# EAGLE design relay_shield3a (EAGLE 7.7.0)
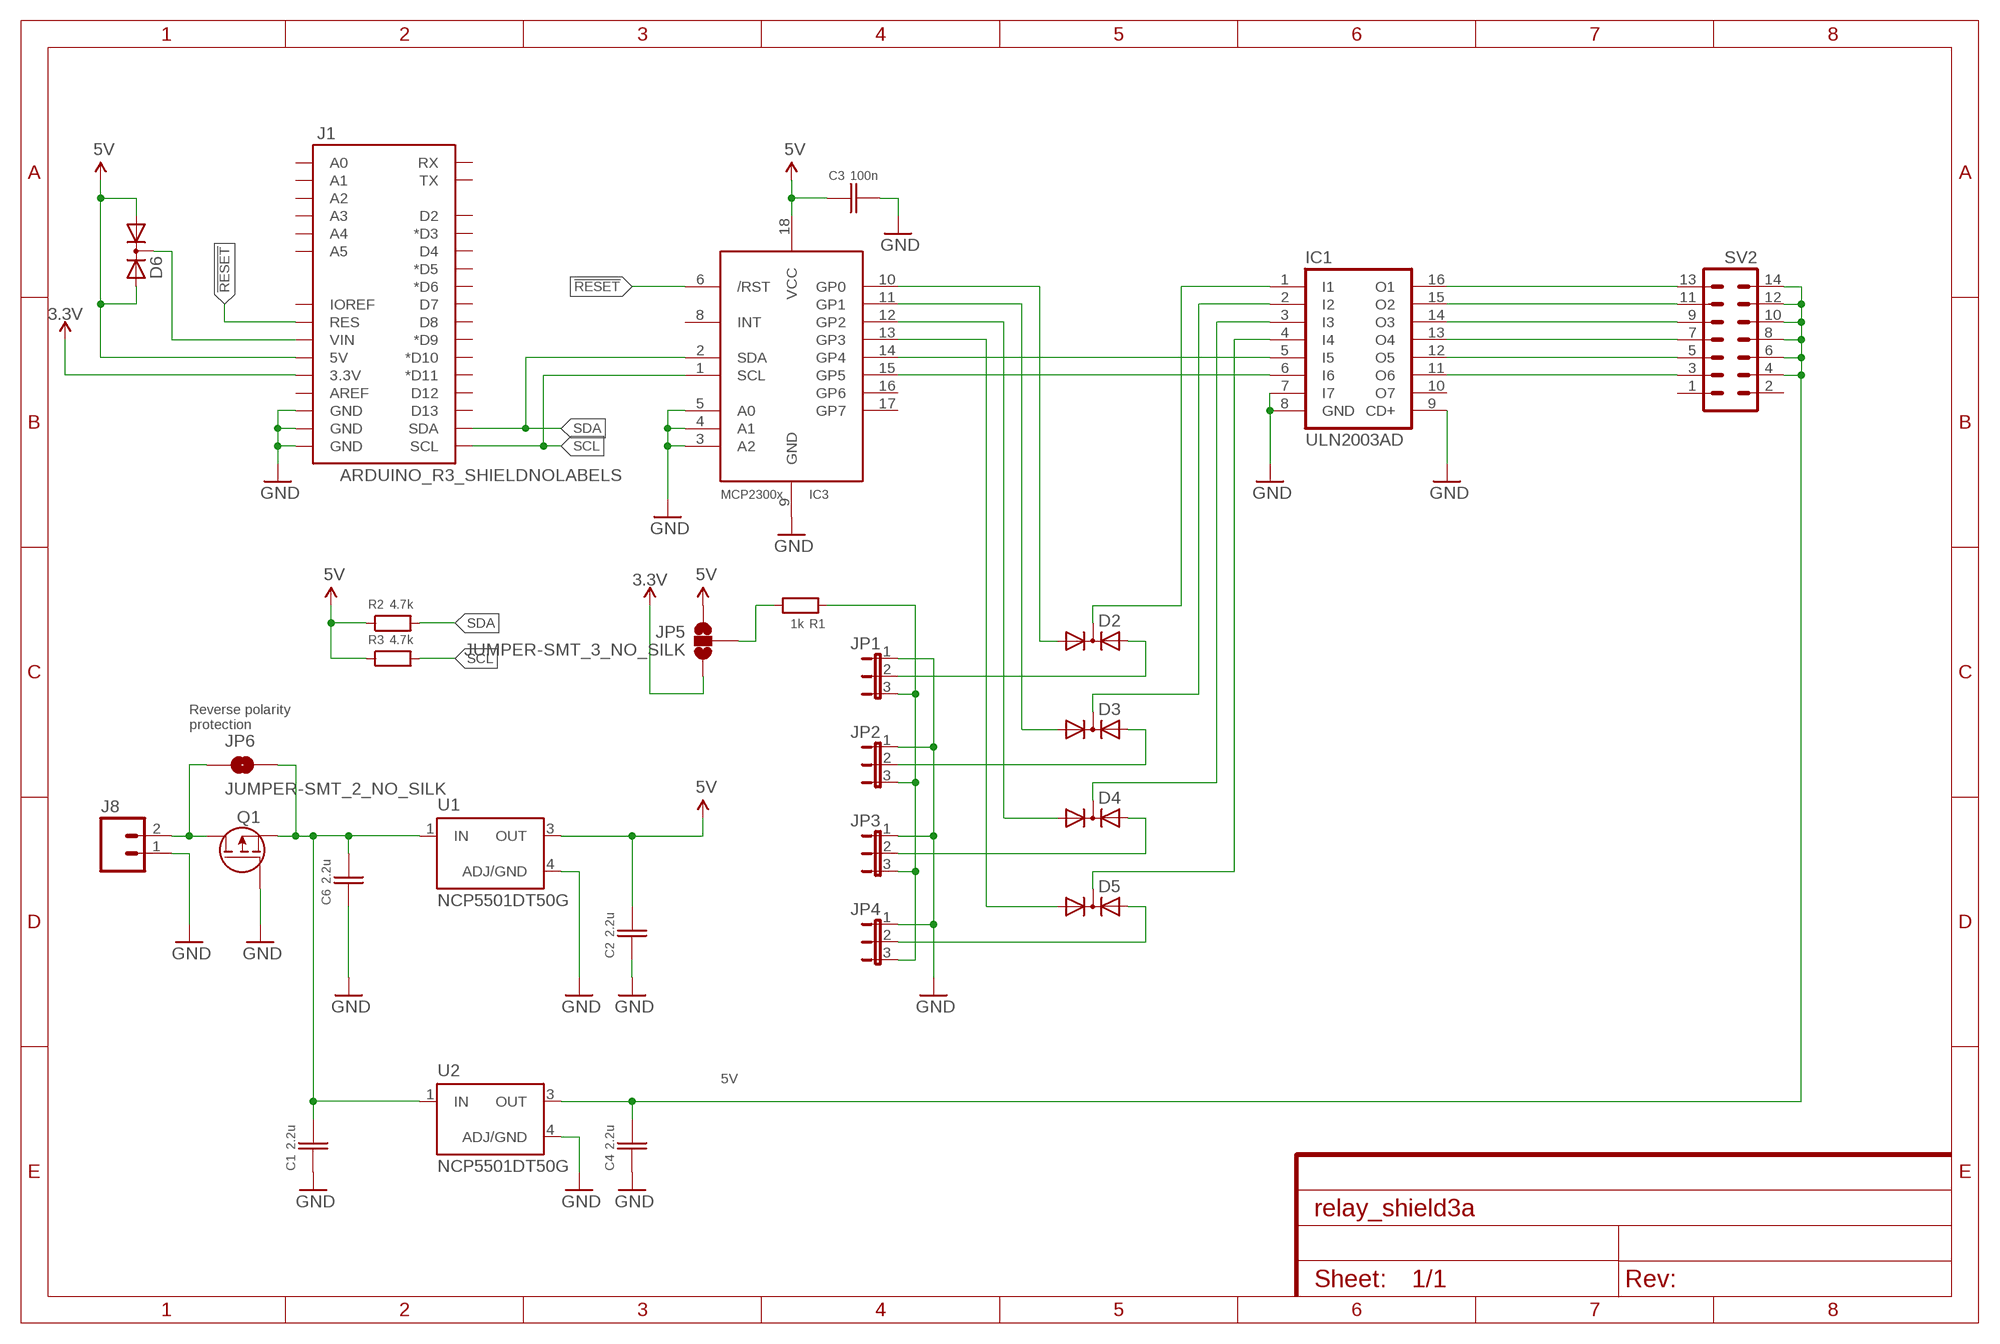
[diagram p0: schematic, sheet 1]

## Parts
C1  2.2u  CAPACITOR_NPOL-1206  [C1206]
C2  2.2u  CAPACITOR_NPOL-1206  [C1206]
C3  100n  CAPACITOR_NPOL-0603  [C603]
C4  2.2u  CAPACITOR_NPOL-1206  [C1206]
C6  2.2u  CAPACITOR_NPOL-1206  [C1206]
D2  DIODE-2AC|CASOT23  [SOT23]
D3  DIODE-2AC|CASOT23  [SOT23]
D4  DIODE-2AC|CASOT23  [SOT23]
D5  DIODE-2AC|CASOT23  [SOT23]
D6  DIODE-2AC|CASOT23  [SOT23]
IC1  ULN2003AD  [SO16]
IC3  MCP23008/SO  [SO18W]
J1  ARDUINO_R3_SHIELDNOLABELS  [UNO_R3_SHIELD_NOLABELS]
J8  M023.5MM  [SCREWTERMINAL-3.5MM-2]
JP1  JP2E  [JP2]
JP2  JP2E  [JP2]
JP3  JP2E  [JP2]
JP4  JP2E  [JP2]
JP5  JUMPER-SMT_3_NO_SILK  [SMT-JUMPER_3_NO_SILK]
JP6  JUMPER-SMT_2_NO_SILK  [SMT-JUMPER_2_NO_SILK]
Q1  MOSFET-P-SOT23-3  [SOT23-3]
R1  1k  RESISTOR-0603  [R0603]
R2  4.7k  RESISTOR-0603  [R0603]
R3  4.7k  RESISTOR-0603  [R0603]
SV2  ML14L  [ML14L]
U1  NCP5501DT50G  VREG-3PIN-DPAK  [DPAK]
U2  NCP5501DT50G  VREG-3PIN-DPAK  [DPAK]

## Nets
3.3V: J1.3.3V JP5.3
5V: C2.2 C3.1 D6.1(A1) D6.2(A2) IC3.18(VCC) J1.5V JP5.1 R2.1 R3.1 U1.3(OUT)
!RESET: IC3.6(/RST) J1.RES
GND: C1.1 C2.1 C3.2 C4.1 C6.1 IC1.7(I7) IC1.8(GND) IC1.9(CD+) IC3.3(A2) IC3.4(A1) IC3.5(A0) IC3.9(GND) J1.GND@0(GND) J1.GND@1(GND) J1.GND@2(GND) J8.1 JP1.1 JP2.1 JP3.1 JP4.1 Q1.1(G) U1.4(ADJ/GND) U2.4(ADJ/GND)
N$1: D2.2(A2) JP1.2
N$2: D3.2(A2) JP2.2
N$3: IC1.16(O1) SV2.13
N$4: C1.2 C6.2 JP6.2 Q1.2(S) U1.1(IN) U2.1(IN)
N$6: C4.2 SV2.4 SV2.6 SV2.8 SV2.10 SV2.12 SV2.14 U2.3(OUT)
N$13: IC1.15(O2) SV2.11
N$14: IC1.14(O3) SV2.9
N$15: IC1.13(O4) SV2.7
N$16: IC1.12(O5) SV2.5
N$17: IC1.11(O6) SV2.3
N$18: D2.3(C) IC1.1(I1)
N$19: D3.3(C) IC1.2(I2)
N$20: D4.3(C) IC1.3(I3)
N$21: D5.3(C) IC1.4(I4)
N$22: IC1.5(I5) IC3.14(GP4)
N$23: IC1.6(I6) IC3.15(GP5)
N$24: D6.3(C) J1.VIN
N$25: D4.2(A2) JP3.2
N$26: D5.2(A2) JP4.2
N$27: D2.1(A1) IC3.10(GP0)
N$28: D3.1(A1) IC3.11(GP1)
N$29: D4.1(A1) IC3.12(GP2)
N$30: D5.1(A1) IC3.13(GP3)
N$31: J8.2 JP6.1 Q1.3(D)
N$44: JP1.3 JP2.3 JP3.3 JP4.3 R1.1
N$47: JP5.2 R1.2
SCL: IC3.1(SCL) J1.SCL R3.2
SDA: IC3.2(SDA) J1.SDA R2.2
Unconnected: IC1.10(O7) IC3.8(INT) IC3.16(GP6) IC3.17(GP7) J1.A0 J1.A1 J1.A2 J1.A3 J1.A4 J1.A5 J1.AREF J1.D2 J1.D3(*D3) J1.D4 J1.D5(*D5) J1.D6(*D6) J1.D7 J1.D8 J1.D9(*D9) J1.D10(*D10) J1.D11(*D11) J1.D12 J1.D13 J1.IOREF J1.RX J1.TX SV2.1 SV2.2

## Notes on the sheet
- Reverse polarity
  protection
- 5V

## Library data of the parts
C1-C4 C6 = kg-generic:CAPACITOR_NPOL: Non-Polarized capacitor in various packages
D2-D6 = diode:DIODE-2AC|CA: Dual DIODE Anode-Cathode|Cathode-Anode
IC1 = uln-udn:ULN2003A: DRIVER ARRAY
IC3 = adafruit:MCP23008: MCP23008 Inexpensive i2c i/o expander - 8 general purpose i/o pins with optional pullups
J1 = SparkFun-Boards:ARDUINO_R3_SHIELD: Shield form compatible with the Arduino Uno R3.
J8 = SparkFun-Connectors:M02: Standard 2-pin 0.1" header. Use with - straight break away headers ( PRT-00116) - right angle break away headers (PRT-00553) - swiss pins (PRT-00743) - machine pins (PRT-00117) - female headers (PRT-00115) Molex polarized connector foot print use with: PRT-08233 with associated crimp pins and housings. 2.54_SCREWTERM for use with PRT-10571. 3.5mm Screw Terminal footprints for PRT-08084 5mm Screw Terminal footprints for use with PRT-08432; PROD_ID: CONN-08399
JP1-JP4 = jumper:JP2E: JUMPER
JP5 = SparkFun-Jumpers:JUMPER-SMT_3_NO: Normally open jumper This jumper has three pads in close proximity to each other. Apply solder to close the connection(s).
JP6 = SparkFun-Jumpers:JUMPER-SMT_2_NO: Normally open jumper This jumper has two pads in close proximity to each other. Apply solder to close the connection. Round pads are easier to solder for beginners, but are a lot larger. SparkFun Product that uses the round pads: SparkFun EL Sequencer <https://www.sparkfun.com/products/12781>
Q1 = kg-generic:MOSFET-P: Generic P-MOSFET IRF7406 SO8 30V 5.8A 45mOhm IRLML6401 SOT23-3 12V 4.3A 50mOhm IRLML6402 SOT23-3 20V 3.7A 65mOhm
R1-R3 = kg-generic:RESISTOR: Generic resistor
SV2 = con-ml:ML14L: HARTING; OC_FARNELL: unknown; OC_NEWARK: unknown
U1 U2 = kg-generic:VREG-3PIN: Generic 3-pin linear voltage regulator

## Board
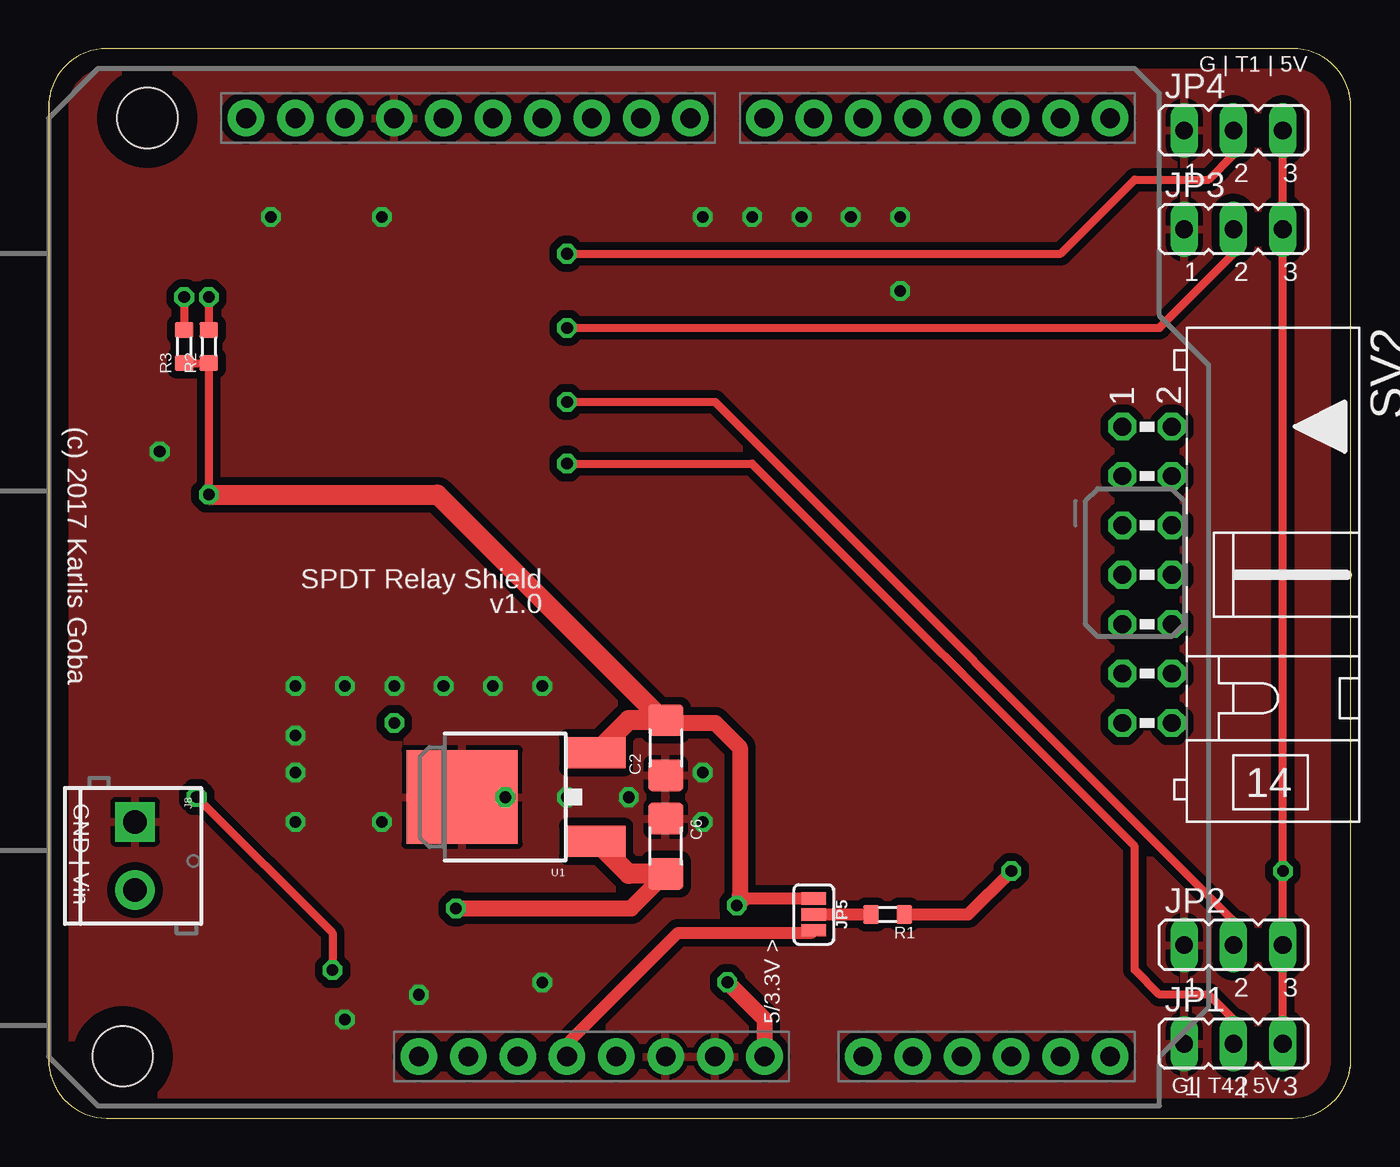
[diagram p1: board, top side]
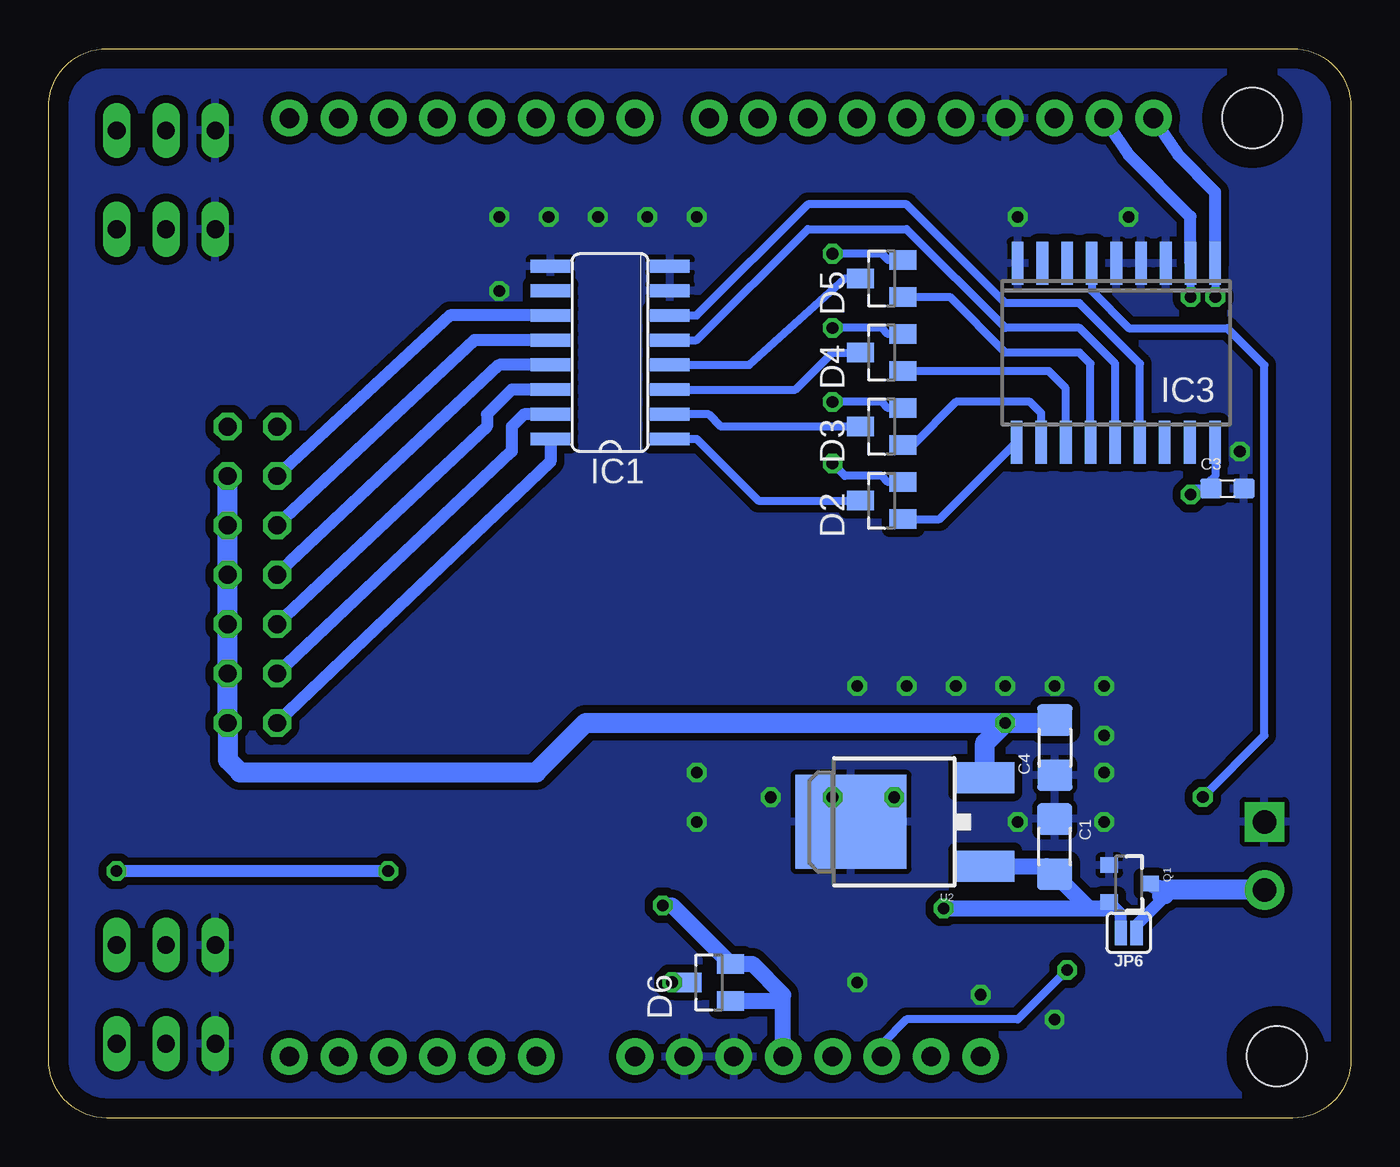
[diagram p2: board, bottom side, seen from below]

Size 67 x 55 mm. Coordinates in mm from the lower left corner, seen from the top.
Outline: 0,52 0,3 arc90 3,0 64,0 arc90 67,3 67,52 arc90 64,55 3,55 arc90 0,52
Copper layers (1*16): Top 0.035mm / dielectric 1.5mm / Bottom 0.035mm
Design rules "default": minimum track width 10mil, minimum drill 24mil, track to track 8mil, track to pad 8mil, pad to pad 8mil, via to via 8mil, smd to smd 8mil, copper to edge 40mil, drill to drill 8mil, minimum pad ring 10mil, minimum via ring 8mil, stop-mask expansion 4mil, vias tented up to drill 0mil, thermal gap 10mil
Holes 3.1 mm at 3.81,3.17 5.08,51.44

### Footprints (pad centres in the part's own frame; a part is rotated, then mirrored left to right if it is on the bottom)
C1206 = smd 1.6 x 1.803: 1 -1.422,0; 2 1.422,0
C603 = smd 1.1 x 1: 1 -0.85,0; 2 0.85,0
SOT23 = smd 1 x 1.4: 1 -0.95,-1.1; 2 0.95,-1.1; 3 0,1.1
SO16 = smd 0.66 x 2.032: 1 -4.445,-3.073; 2 -3.175,-3.073; 3 -1.905,-3.073; 4 -0.635,-3.073; 5 0.635,-3.073; 6 1.905,-3.073; 7 3.175,-3.073; 8 4.445,-3.073; 9 4.445,3.073; 10 3.175,3.073; 11 1.905,3.073; 12 0.635,3.073; 13 -0.635,3.073; 14 -1.905,3.073; 15 -3.175,3.073; 16 -4.445,3.073
SO18W = smd 0.6 x 2.2: 1 -4.445,-4.6; 2 -3.175,-4.6; 3 -1.905,-4.6; 4 -0.635,-4.6; 5 0.635,-4.6; 6 1.905,-4.6; 7 3.175,-4.6; 8 4.445,-4.6; 9 5.715,-4.6; 10 5.775,4.6; 11 4.505,4.6; 12 3.235,4.6; 13 1.965,4.6; 14 0.695,4.6; 15 -0.575,4.6; 16 -1.845,4.6; 17 -3.145,4.6; 18 -4.445,4.6
UNO_R3_SHIELD_NOLABELS = drill 1.016 pad 1.88: 3.3V 50.8,26.67; 5V 50.8,29.21; A0 50.8,41.91; A1 50.8,44.45; A2 50.8,46.99; A3 50.8,49.53; A4 50.8,52.07; A5 50.8,54.61; AREF 2.54,15.24; D2 2.54,49.53; D3 2.54,46.99; D4 2.54,44.45; D5 2.54,41.91; D6 2.54,39.37; D7 2.54,36.83; D8 2.54,33.02; D9 2.54,30.48; D10 2.54,27.94; D11 2.54,25.4; D12 2.54,22.86; D13 2.54,20.32; GND@0 50.8,31.75; GND@1 50.8,34.29; GND@2 2.54,17.78; IOREF 50.8,21.59; NC 50.8,19.05; RES 50.8,24.13; RX 2.54,54.61; SCL 2.54,10.16; SDA 2.54,12.7; TX 2.54,52.07; VIN 50.8,36.83
SCREWTERMINAL-3.5MM-2 = drill 1.2 pad 2.032 square: 1 0,0 | drill 1.2 pad 2.032: 2 3.5,0
JP2 = drill 0.914 long: 1 -2.54,0; 2 0,0; 3 2.54,0
SMT-JUMPER_3_NO_SILK = smd 0.635 x 1.27: 1 -0.813,0; 2 0,0; 3 0.813,0
SMT-JUMPER_2_NO_SILK = smd 0.635 x 1.27: 1 -0.406,0; 2 0.406,0
SOT23-3 = smd 0.8 x 0.9: 1 -0.95,-1; 2 0.95,-1; 3 0,1.1
R0603 = smd 0.8 x 0.95: 1 -0.85,0; 2 0.85,0
ML14L = drill 0.914 octagon: 1 -7.62,-1.27; 2 -7.62,1.27; 3 -5.08,-1.27; 4 -5.08,1.27; 5 -2.54,-1.27; 6 -2.54,1.27; 7 0,-1.27; 8 0,1.27; 9 2.54,-1.27; 10 2.54,1.27; 11 5.08,-1.27; 12 5.08,1.27; 13 7.62,-1.27; 14 7.62,1.27
DPAK = smd 1.6 x 3: 1 -2.28,-5.31; 3 2.28,-5.31 | smd 4.826 x 5.715: 4 0,1.588

### Placement (x,y rotation side)
C1  15.24,13.96 270 bottom
C2  31.75,19.04 90 top
C3  6.35,32.38 0 bottom
C4  15.23,19.05 90 bottom
C6  31.75,13.98 270 top
D2  24.14,31.75 90 bottom
D3  24.14,35.56 90 bottom
D4  24.14,39.37 90 bottom
D5  24.14,43.18 90 bottom
D6  33.02,6.97 90 bottom
IC1  38.11,39.37 90 bottom
IC3  11.43,39.36 180 bottom
J1  0,53.97 270 top
J8  4.45,15.23 270 top
JP1  60.96,3.82 0 top
JP2  60.96,8.9 0 top
JP3  60.96,45.71 0 top
JP4  60.96,50.79 0 top
JP5  39.36,10.47 270 top
JP6  11.43,9.53 180 bottom
Q1  11.43,12.05 270 bottom
R1  43.17,10.47 180 top
R2  8.24,39.68 90 top
R3  6.97,39.68 90 top
SV2  56.52,27.94 270 top
U1  22.86,16.51 90 top
U2  24.13,15.23 90 bottom

### Tracks (layer width: path | path; a pad name or v marks a point on that pad's centre or on a via)
3.3V
  Top 0.61: J1.3.3V 26.67,3.81 32.38,9.53 39.23,9.53 JP5.3
5V  (via drill 0.6)
  Top 0.406: v8.24,32.06 R2.1 R3.1
  Top 0.61: JP5.1 35.75,11.28
  Top 0.813: v35.41,10.94 35.75,11.28 35.56,11.48 35.56,19.05 34.29,20.32 31.75,20.32
  Top 1.016: v8.24,32.06 20.01,32.06 31.75,20.32 C2.2 29.84,20.46 U1.3
  Bottom 0.406: IC3.18 6.99,33.01 7.3,32.69 | 7.3,32.69 7.62,32.38 7.93,32.38 v8.24,32.06 | C3.1 7.2,32.59 7.3,32.69
  Bottom 0.813: J1.5V 29.21,6.34 | D6.1 29.52,6.03 29.21,6.34 | 29.21,6.34 30.8,7.92 D6.2 34.93,10.94 v35.41,10.94
!RESET  (via drill 0.6)
  Top 0.406: v14.61,7.61 14.61,9.53 v7.62,16.51
  Bottom 0.406: IC3.6 13.34,42.53 11.43,40.63 6.35,40.63 4.45,38.73 4.45,19.68 v7.61,16.51 v7.62,16.51 | v14.61,7.61 17.14,5.07 22.86,5.07 24.13,3.8 J1.RES
GND  (via drill 0.6)
  other vias: 19.05,6.34 25.4,6.97 12.7,17.77 17.14,46.34 5.71,34.28 11.43,46.34 15.24,5.07 23.5,16.5 26.67,16.5 33.66,46.34 36.2,46.34 38.73,46.34 41.27,46.34 43.81,46.34 43.81,42.53 17.14,15.23 33.66,17.77 33.66,15.23 29.84,16.5 25.4,22.21 22.86,22.21 20.32,22.21 17.78,22.21 15.24,22.21 12.7,22.21 12.7,19.68 12.7,15.23
  pour Bottom (isolate 0.406): 69.85,63.3 69.85,-3.17 -2.54,-3.17 -2.54,63.3
  pour Top (isolate 0.406): 71.12,64.57 71.12,-4.44 -3.81,-4.44 -3.81,64.57
N$1  (via drill 0.6)
  Top 0.406: JP1.2 60.96,5.08 59.69,6.35 57.15,6.35 55.88,7.62 55.88,13.97 36.2,33.66 v26.67,33.66
  Bottom 0.406: D2.2 23.81,32.7 24.13,33.02 26.04,33.02 v26.67,33.66
N$2  (via drill 0.6)
  Top 0.406: v26.67,36.83 34.29,36.83 60.96,10.16 JP2.2
  Bottom 0.406: D3.2 23.81,36.51 24.13,36.83 v26.67,36.83
N$3
  Bottom 0.61: IC1.16 41.18,33.75 SV2.13
N$4  (via drill 0.6)
  Top 0.813: v20.95,10.79 29.98,10.79 C6.2
  Top 1.016: C6.2 29.84,12.56 U1.1
  Bottom 0.61: JP6.2 11.84,10.51 Q1.2 | 13.38,10.79 13.49,10.79
  Bottom 0.813: v20.95,10.79 13.38,10.79 12.75,10.79 Q1.2 | U2.1 15.65,12.95 C1.2 13.49,10.79
  Bottom 1.27: 15.32,12.46 C1.2
N$6  (via drill 0.6)
  Bottom 1.016: U2.3 18.82,19.28 v17.78,20.32 | v17.78,20.32 15.38,20.32 C4.2 | v17.78,20.32 39.37,20.32 41.91,17.78 57.15,17.78 57.78,18.41 SV2.14 SV2.12 SV2.10 SV2.8 SV2.6 SV2.4
N$13
  Bottom 0.61: IC1.15 42.55,36.2 43.18,35.56 43.18,34.29 SV2.11
N$14
  Bottom 0.61: IC1.14 43.18,37.47 44.45,36.2 44.45,35.56 SV2.9
N$15
  Bottom 0.61: IC1.13 43.81,38.73 54.61,28.57 SV2.7
N$16
  Bottom 0.61: IC1.12 45.09,40.01 SV2.5
N$17
  Bottom 0.61: IC1.11 46.35,41.27 SV2.3
N$18
  Bottom 0.406: IC1.1 33.66,34.92 30.49,31.75 D2.3
N$19
  Bottom 0.406: D3.3 32.4,35.56 33.03,36.2 IC1.2
N$20
  Bottom 0.406: IC1.3 28.59,37.47 26.68,39.37 D4.3
N$21
  Bottom 0.406: IC1.4 30.95,38.73 26.04,43.18 D5.3
N$22
  Bottom 0.406: IC1.5 33.66,40.01 27.94,45.72 22.86,45.72 17.78,40.64 13.97,40.64 12.12,38.8 IC3.14
N$23
  Bottom 0.406: IC3.15 10.86,38.8 13.97,41.91 17.78,41.91 22.86,46.99 27.94,46.99 33.66,41.27 IC1.6
N$24  (via drill 0.6)
  Top 0.813: v34.92,6.99 36.83,5.08 J1.VIN
  Bottom 0.813: D6.3 34.91,6.97 v34.92,6.99
N$25  (via drill 0.6)
  Top 0.406: v26.67,40.64 57.15,40.64 60.96,44.45 JP3.2
  Bottom 0.406: D4.2 23.81,40.32 24.13,40.64 v26.67,40.64
N$26  (via drill 0.6)
  Top 0.406: v26.67,44.45 52.07,44.45 55.88,48.26 59.69,48.26 60.96,49.53 JP4.2
  Bottom 0.406: D5.2 23.81,44.13 24.13,44.45 v26.67,44.45
N$27
  Bottom 0.406: D2.1 21.16,30.8 IC3.10
N$28
  Bottom 0.406: IC3.11 15.94,36.26 16.51,36.83 20.32,36.83 22.54,34.61 D3.1
N$29
  Bottom 0.406: IC3.12 14.66,37.52 15.56,38.42 D4.1
N$30
  Bottom 0.406: IC3.13 13.39,38.8 13.97,39.37 17.78,39.37 20.64,42.23 D5.1
N$31
  Bottom 0.61: JP6.1 11.02,9.93 9.53,11.43 | 9.82,11.43 9.53,11.73
  Bottom 0.813: 9.53,11.73 9.66,11.73 Q1.3 | 9.53,11.43 9.82,11.43
  Bottom 1.016: J8.2 9.53,11.73
N$44  (via drill 0.6)
  Top 0.406: JP1.3 JP2.3 v63.5,12.7 JP3.3 JP4.3
  Top 0.61: R1.1 47.3,10.47 v49.53,12.7
  Bottom 0.61: v49.53,12.7 v63.5,12.7
N$47
  Top 0.61: JP5.2 R1.2
SCL  (via drill 0.6)
  Top 0.406: v6.97,42.22 R3.2
  Bottom 0.406: IC3.1 6.99,42.23 v6.97,42.22
  Bottom 0.61: IC3.1 6.99,47.62 8.89,49.53 J1.SCL
SDA  (via drill 0.6)
  Top 0.406: v8.24,42.22 R2.2
  Bottom 0.406: IC3.2 8.26,42.23 v8.24,42.22
  Bottom 0.61: IC3.2 8.26,46.35 11.43,49.53 J1.SDA

### Text on the board
tPlace: G | T1 | 5V | (c) 2017 Karlis Goba | SPDT Relay Shield | v1.0 | GND | Vin | 5/3.3V > | G | T4 | 5V